# Altium project Elkapod_hardware_controller.PrjPcb
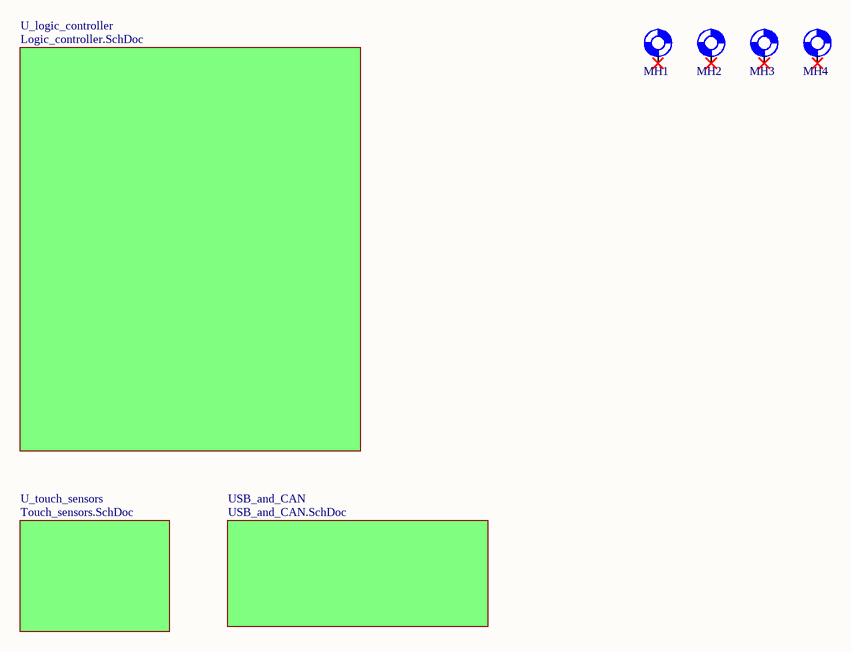
[diagram p0: Schield_elkapod.SchDoc]
4 sheets, 85 parts. Net scope: flat (ports and power ports of the same name join across sheets).
Board file: Elkapod_hardware_controller.PcbDoc
Sheets:
  Schield_elkapod.SchDoc
    U_logic_controller = Logic_controller.SchDoc
    U_touch_sensors = Touch_sensors.SchDoc
    USB_and_CAN = USB_and_CAN.SchDoc

## Sheet Schield_elkapod.SchDoc
size A4; SheetNumber: 1; SheetTotal: 4

### Parts
MH1  M3 Mounting Hole  [M3_MOUNTING_HOLE]  (value not drawn)
MH2  M3 Mounting Hole  [M3_MOUNTING_HOLE]  (value not drawn)
MH3  M3 Mounting Hole  [M3_MOUNTING_HOLE]  (value not drawn)
MH4  M3 Mounting Hole  [M3_MOUNTING_HOLE]  (value not drawn)

### Sub-sheets
U_logic_controller = Logic_controller.SchDoc: no entries
U_touch_sensors = Touch_sensors.SchDoc: no entries
USB_and_CAN = USB_and_CAN.SchDoc: no entries

### Nets

Not connected (* = marked no-connect by the designer): MH1 1*; MH2 1*; MH3 1*; MH4 1*

## Sheet Logic_controller.SchDoc
size A3; SheetNumber: 2; SheetTotal: 6
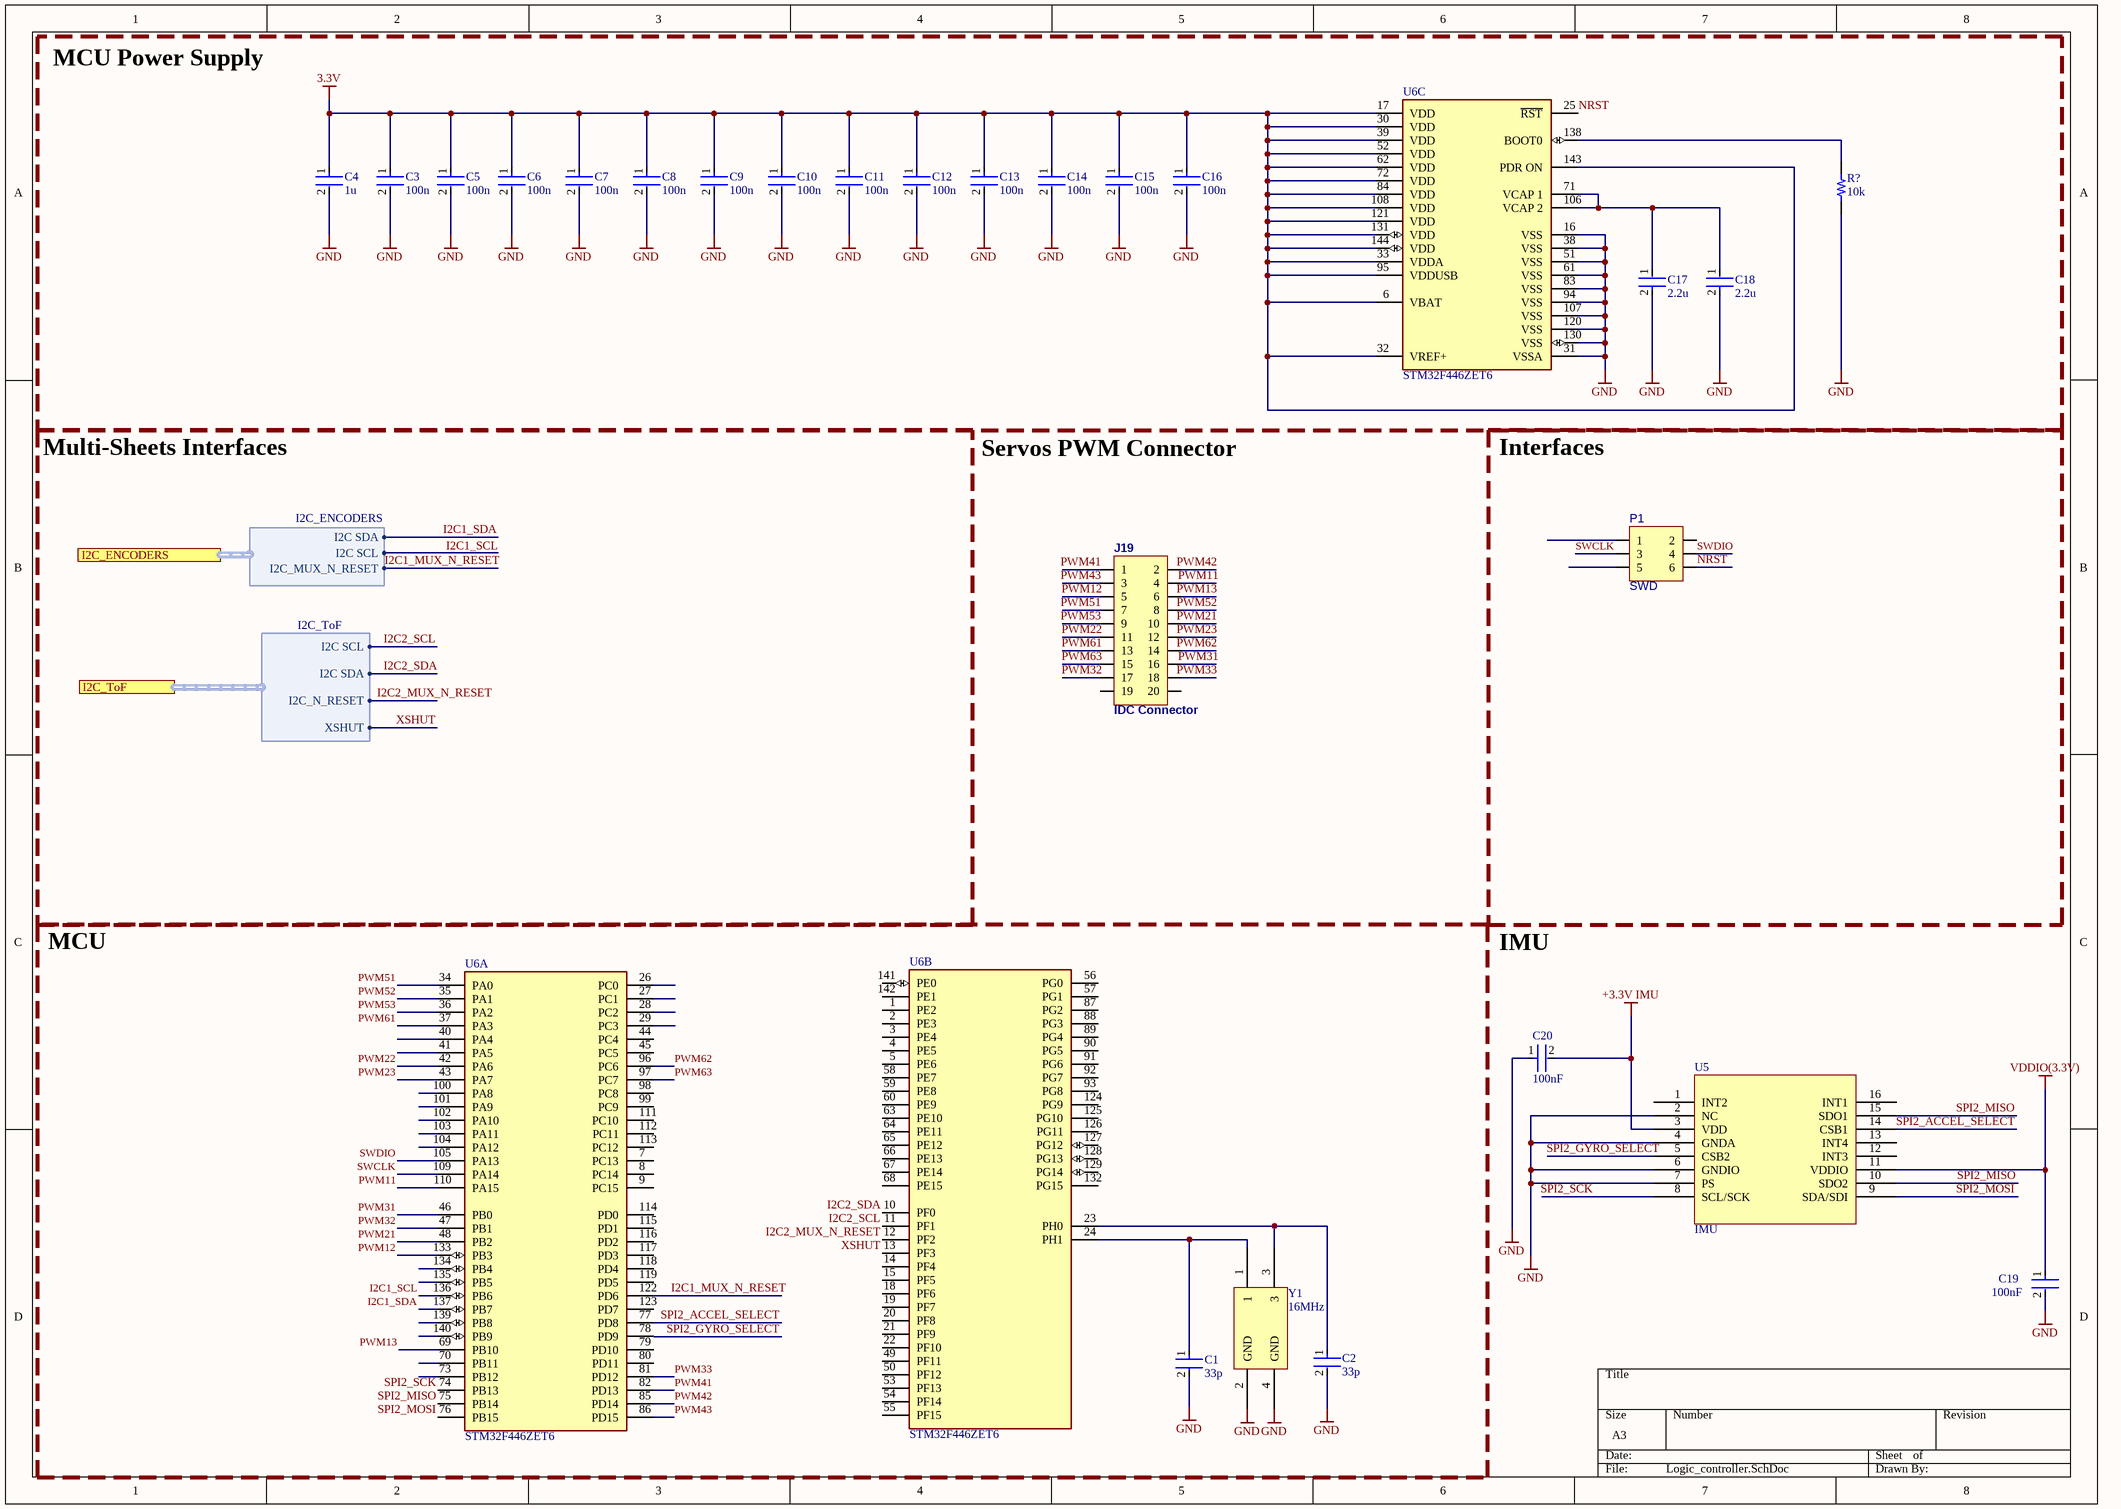
[diagram p1: Logic_controller.SchDoc]

### Parts
(Parts that share a designator on the sheet are numbered #1, #2 ... from top to bottom, then left to right.)
C1#1  33p  [FP-C0603C-CF-MFG]
C2#1  33p  [FP-C0603C-CF-MFG]
C3#1  100n  [FP-C0603C-CF-MFG]
C4#1  1u  [FP-C0603C-CF-MFG]
C5#1  100n  [FP-C0603C-CF-MFG]
C6#1  100n  [FP-C0603C-CF-MFG]
C7#1  100n  [FP-C0603C-CF-MFG]
C8#1  100n  [FP-C0603C-CF-MFG]
C9  100n  [FP-C0603C-CF-MFG]
C10  100n  [FP-C0603C-CF-MFG]
C11  100n  [FP-C0603C-CF-MFG]
C12  100n  [FP-C0603C-CF-MFG]
C13  100n  [FP-C0603C-CF-MFG]
C14  100n  [FP-C0603C-CF-MFG]
C15  100n  [FP-C0603C-CF-MFG]
C16  100n  [FP-C0603C-CF-MFG]
C17  2.2u  [FP-C1608-080-0_1-MFG]
C18  2.2u  [FP-C1608-080-0_1-MFG]
C19  100nF  [FP-CC0603-DA-MFG]
C20  100nF  [FP-CC0603-DA-MFG]
J19  IDC Connector  [IDC20]
P1  SWD  [GP_3x2]
R?  10k  [RES 0603_1608]
U5  IMU  [BMI088-Footprint-1]
U6#1  STM32F446ZET6  [FP-STM32F446ZET6-IPC_C]  (parts A,B,C of 3)
Y1  16MHz  [New footprint 1]

### Blocks framed on the sheet
MCU Power Supply: C3#1 C4#1 C5#1 C6#1 C7#1 C8#1 C9-C18 R? U6#1
Interfaces: P1
MCU: C1#1 C2#1 U6#1 Y1

### Ports
I2C_ENCODERS (harness I2C_ENCODERS, see Schield_elkapod[2B], Connection_of_encoders[1A]), I2C_ToF (harness I2C_ToF, see Schield_elkapod[2A], ToF_sensors[1A])

### Harnesses
I2C_ENCODERS: I2C SDA, I2C SCL, I2C_MUX_N_RESET
I2C_ToF: I2C SCL, I2C SDA, I2C_N_RESET, XSHUT

### Nets
3.3V: C3#1.1 C4#1.1 C5#1.1 C6#1.1 C7#1.1 C8#1.1 C9.1 C10.1 C11.1 C12.1 C13.1 C14.1 C15.1 C16.1 U6#1.6(VBAT) U6#1.17(VDD) U6#1.30(VDD) U6#1.32(VREF+) U6#1.33(VDDA) U6#1.39(VDD) U6#1.52(VDD) U6#1.62(VDD) U6#1.72(VDD) U6#1.84(VDD) U6#1.95(VDDUSB) U6#1.108(VDD) U6#1.121(VDD) U6#1.131(VDD) U6#1.143(PDR_ON) U6#1.144(VDD)
+3.3V IMU: C20.2 U5.3(VDD)
GND: C1#1.2 C2#1.2 C3#1.2 C4#1.2 C5#1.2 C6#1.2 C7#1.2 C8#1.2 C9.2 C10.2 C11.2 C12.2 C13.2 C14.2 C15.2 C16.2 C17.2 C18.2 C19.2 C20.1 R?.2 U5.2(NC) U5.4(GNDA) U5.6(GNDIO) U5.7(PS) U6#1.16(VSS) U6#1.31(VSSA) U6#1.38(VSS) U6#1.51(VSS) U6#1.61(VSS) U6#1.83(VSS) U6#1.94(VSS) U6#1.107(VSS) U6#1.120(VSS) U6#1.130(VSS) Y1.2(GND) Y1.4(GND)
VDDIO(3.3V): C19.1 U5.11(VDDIO)
I2C1_MUX_N_RESET: U6#1.122(PD6) ; port I2C_ENCODERS.I2C_MUX_N_RESET
I2C1_SCL: U6#1.136(PB6) ; port I2C_ENCODERS.I2C SCL
I2C1_SDA: U6#1.137(PB7) ; port I2C_ENCODERS.I2C SDA
I2C2_MUX_N_RESET: U6#1.12(PF2) ; port I2C_ToF.I2C_N_RESET
I2C2_SCL: U6#1.11(PF1) ; port I2C_ToF.I2C SCL
I2C2_SDA: U6#1.10(PF0) ; port I2C_ToF.I2C SDA
NRST: P1.6 U6#1.25(~{RST})
PWM11: J19.4 U6#1.110(PA15)
PWM12: J19.5 U6#1.133(PB3)
PWM13: J19.6 U6#1.69(PB10)
PWM21: J19.10 U6#1.48(PB2)
PWM22: J19.11 U6#1.42(PA6)
PWM23: J19.12 U6#1.43(PA7)
PWM31: J19.16 U6#1.46(PB0)
PWM32: J19.17 U6#1.47(PB1)
PWM33: J19.18 U6#1.81(PD12)
PWM41: J19.1 U6#1.82(PD13)
PWM42: J19.2 U6#1.85(PD14)
PWM43: J19.3 U6#1.86(PD15)
PWM51: J19.7 U6#1.34(PA0)
PWM52: J19.8 U6#1.35(PA1)
PWM53: J19.9 U6#1.36(PA2)
PWM61: J19.13 U6#1.37(PA3)
PWM62: J19.14 U6#1.96(PC6)
PWM63: J19.15 U6#1.97(PC7)
SPI2_ACCEL_SELECT: U5.14(CSB1) U6#1.77(PD8)
SPI2_GYRO_SELECT: U5.5(CSB2) U6#1.78(PD9)
SPI2_MISO: U5.10(SDO2) U5.15(SDO1) U6#1.75(PB14)
SPI2_MOSI: U5.9(SDA/SDI) U6#1.76(PB15)
SPI2_SCK: U5.8(SCL/SCK) U6#1.74(PB13)
SWCLK: P1.3 U6#1.109(PA14)
SWDIO: P1.4 U6#1.105(PA13)
XSHUT: U6#1.13(PF3) ; port I2C_ToF.XSHUT
NetC1#1_1: C1#1.1 U6#1.24(PH1) Y1.1
NetC2#1_1: C2#1.1 U6#1.23(PH0) Y1.3
NetC17_1: C17.1 C18.1 U6#1.71(VCAP_1) U6#1.106(VCAP_2)
NetR?_1: R?.1 U6#1.138(BOOT0)

Not connected (* = marked no-connect by the designer): J19 19 20; P1 1 2 5; U5 1(INT2) 12(INT3) 13(INT4) 16(INT1); U6#1 1(PE2) 2(PE3) 3(PE4) 4(PE5) 5(PE6) 7(PC13) 8(PC14) 9(PC15) 14(PF4) 15(PF5) 18(PF6) 19(PF7) 20(PF8) 21(PF9) 22(PF10) 26(PC0) 27(PC1) 28(PC2) 29(PC3) 40(PA4) 41(PA5) 44(PC4) 45(PC5) 49(PF11) 50(PF12) 53(PF13) 54(PF14) 55(PF15) 56(PG0) 57(PG1) 58(PE7) 59(PE8) 60(PE9) 63(PE10) 64(PE11) 65(PE12) 66(PE13) 67(PE14) 68(PE15) 70(PB11) 73(PB12) 79(PD10) 80(PD11) 87(PG2) 88(PG3) 89(PG4) 90(PG5) 91(PG6) 92(PG7) 93(PG8) 98(PC8) 99(PC9) 100(PA8) 101(PA9) 102(PA10) 103(PA11) 104(PA12) 111(PC10) 112(PC11) 113(PC12) 114(PD0) 115(PD1) 116(PD2) 117(PD3) 118(PD4) 119(PD5) 123(PD7) 124(PG9) 125(PG10) 126(PG11) 127(PG12) 128(PG13) 129(PG14) 132(PG15) 134(PB4) 135(PB5) 139(PB8) 140(PB9) 141(PE0) 142(PE1)

### Notes on the sheet
- Multi-Sheets Interfaces
- Servos PWM Connector
- IMU

### Library data of the parts
C1#1 C2#1 = CMP-03020-030291-1: Cap Ceramic 0.0027uF 25V C0G 1% SMD 0603 125°C Paper T/R; Manufacturer: KEMET; Manufacturer Part Number: C0603C272F3GAC7867; Automotive Grade: Grade 1; Tolerance: 0.01; Value: 2,700 pF; Temperature Coefficient: 30ppm/°C; Material: Ceramic; Device Class L2: Capacitors; Device Class L3: Ceramic Capacitors; ComponentLink2Description: Datasheet; Category: Cap; Automotive: Yes; Octopart: https://octopart.com/c0603c272f3gac7867-kemet-90390867; Temperature Range High: +125°C; Package: C0603C-CF; Device Class L1: Passive Components; Digikey Description: Cap Ceramic 0.0027uF 25V C0G 1% SMD 0603 125°C Paper T/R; Temperature Characteristic: C0G; Temperature Range Low: -55°C; Temperature: -55°C to +125°C; Height: 0.87mm; ComponentLink2URL: https://api.kemet.com/component-edge/download/datasheet/C0603C100J5GACAUTO.pdf; Voltage Rating: 25 V; Capacitance: 2,700 pF; Lead Free: Yes; RoHS: TRUE
C3#1 C5#1 C6#1 C7#1 C8#1 C9-C16 = CMP-03020-030291-1: CAP CER 100nF 25V X5R 0603 C0603C272F3GAC7867; Manufacturer: KEMET; Material: Ceramic; Automotive Grade: Grade 1; Tolerance: 0.01; Temperature Characteristic: C0G; Value: 2,700 pF; Temperature Coefficient: 30ppm/°C; Device Class L2: Capacitors; Device Class L3: Ceramic Capacitors; ComponentLink2Description: Datasheet; Category: Cap; Automotive: Yes; Octopart: https://octopart.com/c0603c272f3gac7867-kemet-90390867; Temperature Range High: +125°C; Package: C0603C-CF; Device Class L1: Passive Components; Digikey Description: Cap Ceramic 0.0027uF 25V C0G 1% SMD 0603 125°C Paper T/R; Temperature Range Low: -55°C; Temperature: -55°C to +125°C; Height: 0.87mm; ComponentLink2URL: https://api.kemet.com/component-edge/download/datasheet/C0603C100J5GACAUTO.pdf; Voltage Rating: 25 V; Capacitance: 2,700 pF; Lead Free: Yes; Manufacturer Part Number: C0603C272F3GAC7867; RoHS: TRUE
C4#1 = CMP-03020-030291-1: CAP CER 1uF 16V X5R 0603 C0603C272F3GAC7867; Manufacturer: KEMET; Material: Ceramic; Automotive Grade: Grade 1; Tolerance: 0.01; Temperature Characteristic: C0G; Value: 2,700 pF; Voltage Rating: 25 V; Temperature Coefficient: 30ppm/°C; Device Class L2: Capacitors; Device Class L3: Ceramic Capacitors; ComponentLink2Description: Datasheet; Category: Cap; Automotive: Yes; Octopart: https://octopart.com/c0603c272f3gac7867-kemet-90390867; Temperature Range High: +125°C; Package: C0603C-CF; Device Class L1: Passive Components; Digikey Description: Cap Ceramic 0.0027uF 25V C0G 1% SMD 0603 125°C Paper T/R; Temperature Range Low: -55°C; Temperature: -55°C to +125°C; Height: 0.87mm; ComponentLink2URL: https://api.kemet.com/component-edge/download/datasheet/C0603C100J5GACAUTO.pdf; Capacitance: 2,700 pF; Lead Free: Yes; Manufacturer Part Number: C0603C272F3GAC7867; RoHS: TRUE
C17 C18 = CMP-08246-003049-1: Multilayer Ceramic Capacitors 2.2μF ±10% 25V X5R SMD 0603 C1608X5R1E225K080AB; Capacitance: 2.2uF; Termination: SMD/SMT; Dielectric Material: Ceramic; REACH SVHC: No SVHC; Voltage Rating (DC): 25V; Voltage Rating: 25V; RoHS Compliant: Yes; Case Code (Imperial): 0603; Case/Package: 0603; Height: 0.8mm; Mount: Surface Mount; Min Operating Temperature: -55°C; Tolerance: 10%; Radiation Hardening: No; Dielectric: X5R; Depth: 0.8mm; Package Quantity: 4000; Length: 1.6mm; Weight: 7.1E-05oz; Resistor Type: Ceramic; Series: C; Thickness: 0.035inch; Width: 0.031inch; Case Code (Metric): 1608; Lead Free: Lead Free; Max Operating Temperature: 85°C; Packaging: Tape and Reel
C19 C20 = CMP-2100-03601-2: CAP CER 0.1UF 50V X7R 0603 CC0603KRX7R9BB104; Manufacturer: YAGEO; Material: Ceramic; Temperature Coefficient: 15%; Tolerance: 0.1; Height: 0.9mm; Voltage: 50 V; ComponentLink2Description: Datasheet; Device Class L2: Capacitors; Temperature Range High: +125°C; Category: Cap; Capacitance: 100 nF; Footprint Url: http://www.yageo.com/exep/pages/download/literatures/UPY-C_GEN_24.pdf; ComponentLink2URL: http://www.yageo.com/documents/recent/UPY-GPHC_X7R_6.3V-to-50V_18.pdf; Package: CC0603-DA; Temperature: -55°C to +125°C; Voltage Rating: 50 V; Temperature Characteristic: X7R; Device Class L1: Passive Components; Temperature Range Low: -55°C; Manufacturer Part Number: CC0603KRX7R9BB104; RoHS: TRUE; Automotive: No; Value: 100 nF; Device Class L3: Ceramic Capacitors; Octopart: https://octopart.com/cc0603krx7r9bb104-yageo-42244635; Mouser Description: Multilayer Ceramic Capacitor, CC Series, 0.1 - F, - 10%, X7R, 50 V, 0603 [1608 Metric]; Lead Free: Yes; Digikey Description: CAP CER 0.1UF 50V X7R 0603
J19 = CN_10x2
P1 = CN_3x2
R? = RNCS0603BKE10K0: RES 10K OHM 1% 0,1W 0603; Manufacturer: Stackpole Electronics Inc; Power (Watts): 0.063W, 1/16W; Temperature Coefficient: ±25ppm/°C; Tolerance: ±0.1%; Part Number: RNCS0603BKE10K0; Value: 10k; Composition: Thin Film; Device Package: 0603 (1608 Metric); Features: Anti-Corrosive, Automotive AEC-Q200, Moisture Resistant; Height - Seated (Max): 0.022" (0.55mm); LastUpdated: 09.02.2024 20:43:37; Lifecycle Status: Active; Minimum Order: 1; Number of Terminations: 2; Operating Temperature: -55°C ~ 155°C; Package / Case: 0603 (1608 Metric); Packaging: TapeAndReel; PartId: 4838; Part Status: Active; Price: 0.06; Ratings: AEC-Q200; Resistance: 10k; Series: RNCS; Size / Dimension: 0.061" L x 0.031" W (1.55mm x 0.80mm); Supplier Device Package: 0603
U5 = CMP-00030-00005-6: BMI088 Series 3.6 V 6 Axis Digital Output Accelerometer Motion Sensor - LGA-16
U6#1 = CMP-12105-000067-1: IC MCU 32BIT 512KB FLASH 144LQFP; Manufacturer: STMicroelectronics; Standoff Height: 0.05mm; Memory Size: 512KBytes; Data Bus Width: 32bits; Number Of Timers/Counters: 14; Number Of I2C Channels: 4; Number Of Usb Channels: 2; Frequency: 180MHz; Ram Size: 128KBytes; Number Of I/Os: 114; Min Supply Voltage: 1.7V; Max Junction Temp: +105°C; Number Of Cores: 1; Core Architecture: Arm Cortex-M4; Max Supply Voltage: 3.6V; Number Of Adc Channels: 24; Number Of Pwm Channels: 32; Number Of Uart Channels: 6; Number Of A/D Converters: 3; Interface: I2C,SPI,UART,USART,EBI/EMI,CAN,USB,LIN,IrDA,I2S,SMBus,Other; Mouser Description: 32 Bit Microcontroller, High Performance, Arm Cortex-M4, 180 Mhz, 512 Kb, 128 Kb, 144, Lqfp; Temperature Range High: +105°C; Device Class L3: Microcontrollers; Ambient Temperature Range High: +85°C; Lead Free: Yes; Octopart: https://octopart.com/stm32f446zet6-stmicroelectronics-52642927; Device Class L2: Embedded Processors and Controllers; Height: 1.6mm; Category: IC; Manufacturer Part Number: STM32F446ZET6; RoHS: TRUE; Memory Type: FLASH; Temperature: -40°C to +105°C; Number Of Spi Channels: 4; Device Class L1: Integrated Circuits (ICs); Package: LQFP144; Digikey Description: IC MCU 32BIT 512KB FLASH 144LQFP; Automotive: No; ComponentLink2Description: Datasheet; ComponentLink2URL: https://www.st.com/content/ccc/resource/technical/document/datasheet/65/cb/75/50/53/d6/48/24/DM00141306.pdf/files/DM00141306.pdf/jcr:content/translations/en.DM00141306.pdf; Ambient Temperature Range Low: -40°C; Temperature Range Low: -40°C
Y1 = CMP-00030-00007-3: resonator 16MHz LFXTAL030819BULK

## Sheet Touch_sensors.SchDoc
size A4; SheetNumber: 4; SheetTotal: 4
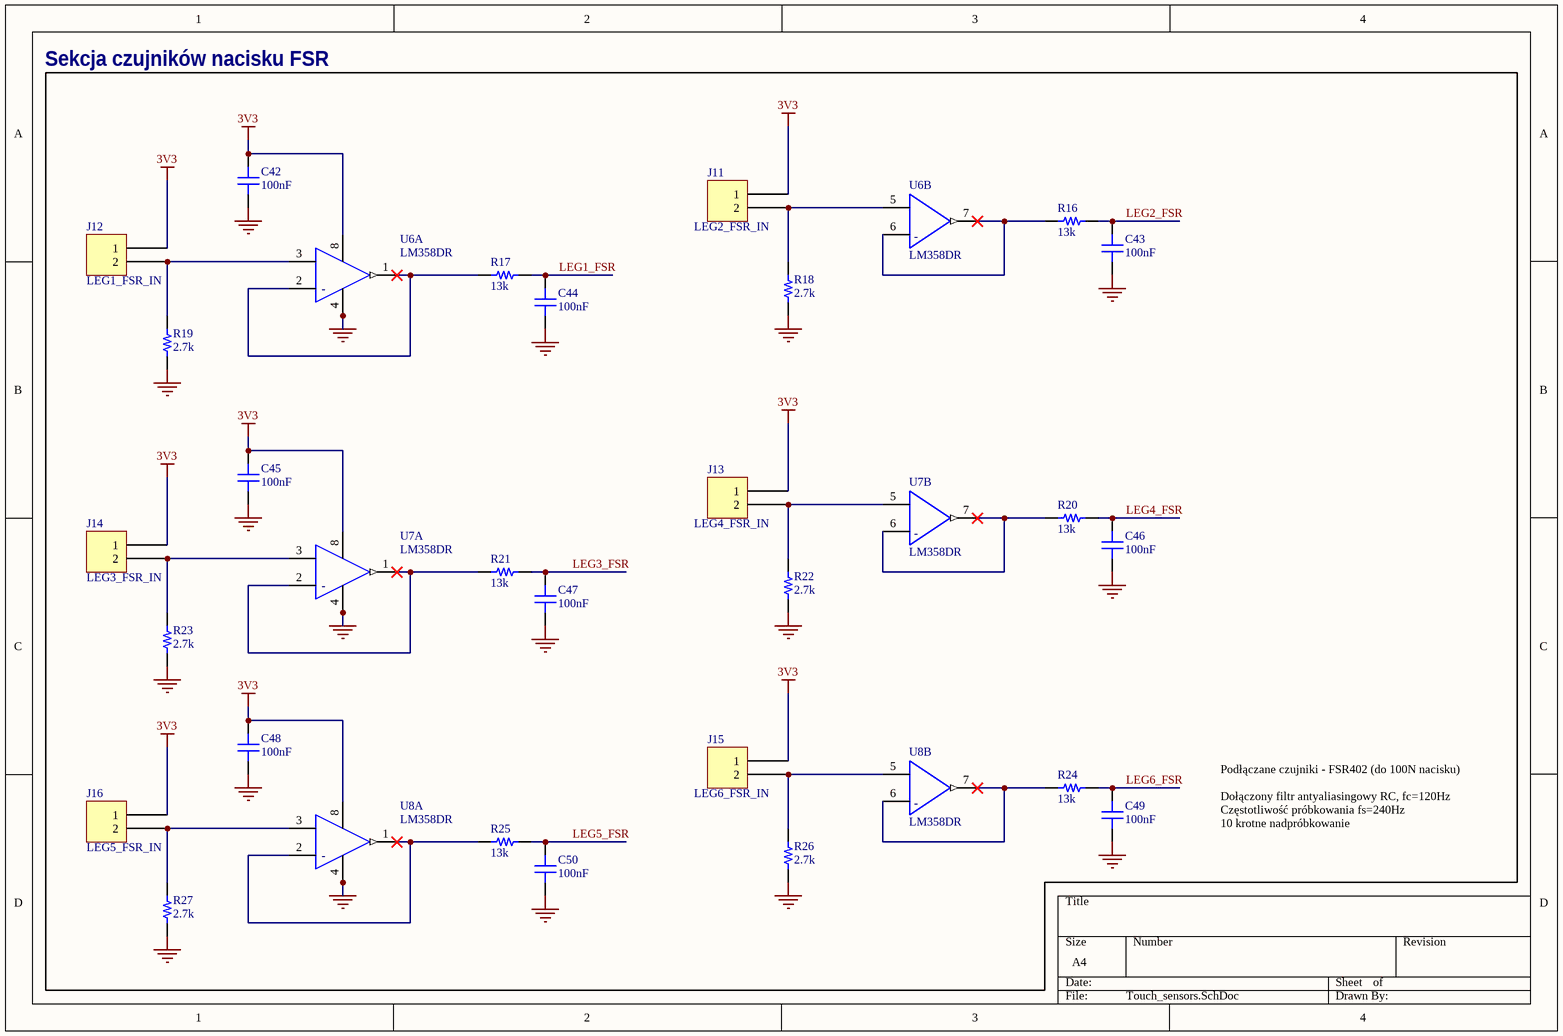
[diagram p2: Touch_sensors.SchDoc]

### Parts
(Parts that share a designator on the sheet are numbered #1, #2 ... from top to bottom, then left to right.)
C42  Capacitance: 100nF  [CAP 0603_1608]  (hidden comment: 0.1 µF)
C43  Capacitance: 100nF  [CAP 0603_1608]  (hidden comment: 0.1 µF)
C44  Capacitance: 100nF  [CAP 0603_1608]  (hidden comment: 0.1 µF)
C45  Capacitance: 100nF  [CAP 0603_1608]  (hidden comment: 0.1 µF)
C46  Capacitance: 100nF  [CAP 0603_1608]  (hidden comment: 0.1 µF)
C47  Capacitance: 100nF  [CAP 0603_1608]  (hidden comment: 0.1 µF)
C48  Capacitance: 100nF  [CAP 0603_1608]  (hidden comment: 0.1 µF)
C49  Capacitance: 100nF  [CAP 0603_1608]  (hidden comment: 0.1 µF)
C50  Capacitance: 100nF  [CAP 0603_1608]  (hidden comment: 0.1 µF)
J11  LEG2_FSR_IN  [JST XH B2B-XH-A]
J12  LEG1_FSR_IN  [JST XH B2B-XH-A]
J13  LEG4_FSR_IN  [JST XH B2B-XH-A]
J14  LEG3_FSR_IN  [JST XH B2B-XH-A]
J15  LEG6_FSR_IN  [JST XH B2B-XH-A]
J16  LEG5_FSR_IN  [JST XH B2B-XH-A]
R16  13k  [RES 0603_1608]
R17  13k  [RES 0603_1608]
R18  2.7k  [YAGEO RES 0603_1608]
R19  2.7k  [YAGEO RES 0603_1608]
R20  13k  [RES 0603_1608]
R21  13k  [RES 0603_1608]
R22  2.7k  [YAGEO RES 0603_1608]
R23  2.7k  [YAGEO RES 0603_1608]
R24  13k  [RES 0603_1608]
R25  13k  [RES 0603_1608]
R26  2.7k  [YAGEO RES 0603_1608]
R27  2.7k  [YAGEO RES 0603_1608]
U6#2  LM358DR  [FP-D0008A-MFG]  (parts A,B of 2)
U7  LM358DR  [FP-D0008A-MFG]  (parts A,B of 2)
U8  LM358DR  [FP-D0008A-MFG]  (parts A,B of 2)

### Nets
3V3: C42.2 C45.2 C48.2 J11.1 J12.1 J13.1 J14.1 J15.1 J16.1 U6#2.8(V+) U7.8(V+) U8.8(V+)
GND: C42.1 C43.1 C44.1 C45.1 C46.1 C47.1 C48.1 C49.1 C50.1 R18.1 R19.1 R22.1 R23.1 R26.1 R27.1 U6#2.4(V-) U7.4(V-) U8.4(V-)
LEG1_FSR: C44.2 R17.2
LEG2_FSR: C43.2 R16.2
LEG3_FSR: C47.2 R21.2
LEG4_FSR: C46.2 R20.2
LEG5_FSR: C50.2 R25.2
LEG6_FSR: C49.2 R24.2
NetJ11_2: J11.2 R18.2 U6#2.5(IN2+)
NetJ12_2: J12.2 R19.2 U6#2.3(IN1+)
NetJ13_2: J13.2 R22.2 U7.5(IN2+)
NetJ14_2: J14.2 R23.2 U7.3(IN1+)
NetJ15_2: J15.2 R26.2 U8.5(IN2+)
NetJ16_2: J16.2 R27.2 U8.3(IN1+)
NetR16_1: R16.1 U6#2.6(IN2-) U6#2.7(2OUT)
NetR17_1: R17.1 U6#2.1(1OUT) U6#2.2(IN1-)
NetR20_1: R20.1 U7.6(IN2-) U7.7(2OUT)
NetR21_1: R21.1 U7.1(1OUT) U7.2(IN1-)
NetR24_1: R24.1 U8.6(IN2-) U8.7(2OUT)
NetR25_1: R25.1 U8.1(1OUT) U8.2(IN1-)

### Notes on the sheet
- Sekcja czujników nacisku FSR
- Podłączane czujniki - FSR402 (do 100N nacisku)
  Dołączony filtr antyaliasingowy RC, fc=120Hz
  Częstotliwość próbkowania fs=240Hz
  10 krotne nadpróbkowanie
- (in symbol CMP-1685-00009-2, part A) -
- (in symbol CMP-1685-00009-2, part B) -

### Library data of the parts
C42-C50 = CL10B104KA8NNNC: CAP CER 0.1UF 25V X7R 0603; manufacturer: Samsung Electro-Mechanics; Tolerance: ±10%; Part Number: CL10B104KA8NNNC; Applications: General Purpose; componentlink1description: Datasheet; componentlink1url: http://www.samsungsem.com/kr/support/product-search/mlcc/CL10B104KA8NNNC.jsp; componentlink2description: DigiKey Link; componentlink2url: https://www.digikey.com/en/products/detail/samsung-electro-mechanics/CL10B104KA8NNNC/3886664; Device Package: 0603 (1608 Metric); lastupdated: 09/02/2024 20:10:20; Lifecycle Status: Active; Minimum Order: 1; Mounting Type: Surface Mount, MLCC; Operating Temperature: -55°C ~ 125°C; Package / Case: 0603 (1608 Metric); packaging: TapeAndReel; partid: 9793; Part Status: Active; price: 0.01; series: CL; Size / Dimension: 0.063" L x 0.031" W (1.60mm x 0.80mm); Supplier 1: DigiKey; Supplier Part Number 1: 1276-1006-1-ND; Temperature Coefficient: X7R; Thickness (Max): 0.035" (0.90mm); value: 0.1 µF; Voltage - Rated: 25V
J11-J16 = B2B-XH-A(LF)(SN): CONN HEADER VERT 2POS 2.5MM; Manufacturer: JST Sales America Inc.; Contact Length - Post: 0.134" (3.40mm); Current Rating (Amps): 3A; Material Flammability Rating: UL94 V-0; Number of Positions: 2; Number of Positions Loaded: All; Pitch - Mating: 0.098" (2.50mm); Shrouding: Shrouded - 4 Wall; Style: Board to Cable/Wire; Voltage Rating: 250V; Part Number: B2B-XH-A(LF)(SN); ComponentLink1Description: Datasheet; ComponentLink1URL: http://www.jst-mfg.com/product/pdf/eng/eXH.pdf; ComponentLink2Description: DigiKey Link; ComponentLink2URL: http://digikey.com/product-detail/en/jst-sales-america-inc/B2B-XH-A-LF-SN/455-2247-ND/1651045; Connector Type: Header; Contact Finish - Mating: Tin; Contact Finish - Post: Tin; Contact Material: Brass; Contact Shape: Square; Contact Type: Male Pin; Fastening Type: Detent Lock; Insulation Color: Natural; Insulation Height: 0.276" (7.00mm); Insulation Material: Polyamide (PA66), Nylon 6/6; LastUpdated: 12/01/2020 23:46:08; Lifecycle Status: Active; Minimum Order: 1; Mounting Type: Through Hole; Number of Rows: 1; Operating Temperature: -25°C ~ 85°C; Packaging: Bulk; PartId: 67; Part Status: Active; Price: 0.15; Series: XH; Supplier 1: DigiKey; Supplier Part Number 1: 455-2247-ND; Termination: Press-Fit, Solder
R16 R17 R20 R21 R24 R25 = ERJ-3EKF1302V: RES SMD 13K OHM 1% 1/10W 0603; Manufacturer: Panasonic Electronic Components; Power (Watts): 0.1W, 1/10W; Resistance: 13 kOhms; Temperature Coefficient: ±100ppm/°C; Part Number: ERJ-3EKF1302V; Value: 13k; ComponentLink1Description: Datasheet; ComponentLink1URL: https://industrial.panasonic.com/cdbs/www-data/pdf/RDA0000/AOA0000C304.pdf; ComponentLink2Description: DigiKey Link; ComponentLink2URL: https://www.digikey.com/en/products/detail/panasonic-electronic-components/ERJ-3EKF1302V/196110; Composition: Thick Film; Device Package: 0603 (1608 Metric); Features: Automotive AEC-Q200; Height - Seated (Max): 0.022" (0.55mm); LastUpdated: 09/02/2024 20:42:14; Lifecycle Status: Active; Minimum Order: 1; Number of Terminations: 2; Operating Temperature: -55°C ~ 155°C; Package / Case: 0603 (1608 Metric); Packaging: TapeAndReel; PartId: 24117; Part Status: Active; Price: 0.01; Ratings: AEC-Q200; Series: ERJ-3EK; Size / Dimension: 0.063" L x 0.031" W (1.60mm x 0.80mm); Supplier 1: DigiKey; Supplier Part Number 1: P13.0KHCT-ND; Supplier Device Package: 0603; Tolerance: ±1%
R18 R19 R22 R23 R26 R27 = AC0603FR-072K7L: RES SMD 2.7K OHM 1% 1/10W 0603; Manufacturer: Yageo; Power (Watts): 0.1W, 1/10W; Resistance: 2.7 kOhms; Temperature Coefficient: ±100ppm/°C; Part Number: AC0603FR-072K7L; Value: 2.7k; ComponentLink1Description: Datasheet; ComponentLink1URL: https://www.yageo.com/upload/media/product/productsearch/datasheet/rchip/PYu-AC_51_RoHS_L_7.pdf; ComponentLink2Description: DigiKey Link; ComponentLink2URL: https://www.digikey.com/en/products/detail/yageo/AC0603FR-072K7L/5895994; Composition: Thick Film; Device Package: 0603 (1608 Metric); Features: Automotive AEC-Q200, Moisture Resistant; Height - Seated (Max): 0.022" (0.55mm); LastUpdated: 25/07/2024 09:19:23; Lifecycle Status: Active; Minimum Order: 1; Number of Terminations: 2; Operating Temperature: -55°C ~ 155°C; Package / Case: 0603 (1608 Metric); Packaging: CutTape; PartId: 17370; Part Status: Active; Price: 0.01; Ratings: AEC-Q200; Series: AC; Size / Dimension: 0.063" L x 0.031" W (1.60mm x 0.80mm); Supplier 1: DigiKey; Supplier Part Number 1: YAG3589CT-ND; Supplier Device Package: 0603; Tolerance: ±1%
U6#2 U7 U8 = CMP-1685-00009-2: IC OPAMP GP 2 CIRCUIT 8SOIC; Output Current: 30mA; Min Dual Supply Voltage: 1.5V; Input Offset Voltage (Vos): 7mV; Power Supply Rejection Ratio (PSRR): 65dB; Unity Gain Bandwidth Product: 700kHz; Number of Channels: 2; Min Supply Voltage: 3V; Max Dual Supply Voltage: 16V; Dual Supply Voltage: 9V; Max Supply Voltage: 32V; Nominal Supply Current: 1.2mA; Slew Rate: 0.3V/µs; Input Bias Current: 250nA; Voltage Gain: 100dB; Operating Supply Current: 1mA; REACH SVHC: No SVHC; Package Quantity: 2500; Width: 3.91mm; Max Operating Temperature: 70°C; Min Operating Temperature: 0°C; Mount: Surface Mount; Length: 4.9mm; Radiation Hardening: No; Case/Package: SOIC; Lead Free: Lead Free; Number of Elements: 2; Packaging: Tape and Reel; Output Current per Channel: 30mA; Number of Circuits: 2; Bandwidth: 700kHz; Operating Supply Voltage: 16V; Gain Bandwidth Product: 700kHz; Number of Pins: 8; Number of Amplifiers: 2; Height: 1.58mm; Common Mode Rejection Ratio: 65dB; Contact Plating: Gold

## Sheet USB_and_CAN.SchDoc
size A4; SheetNumber: 2; SheetTotal: 4
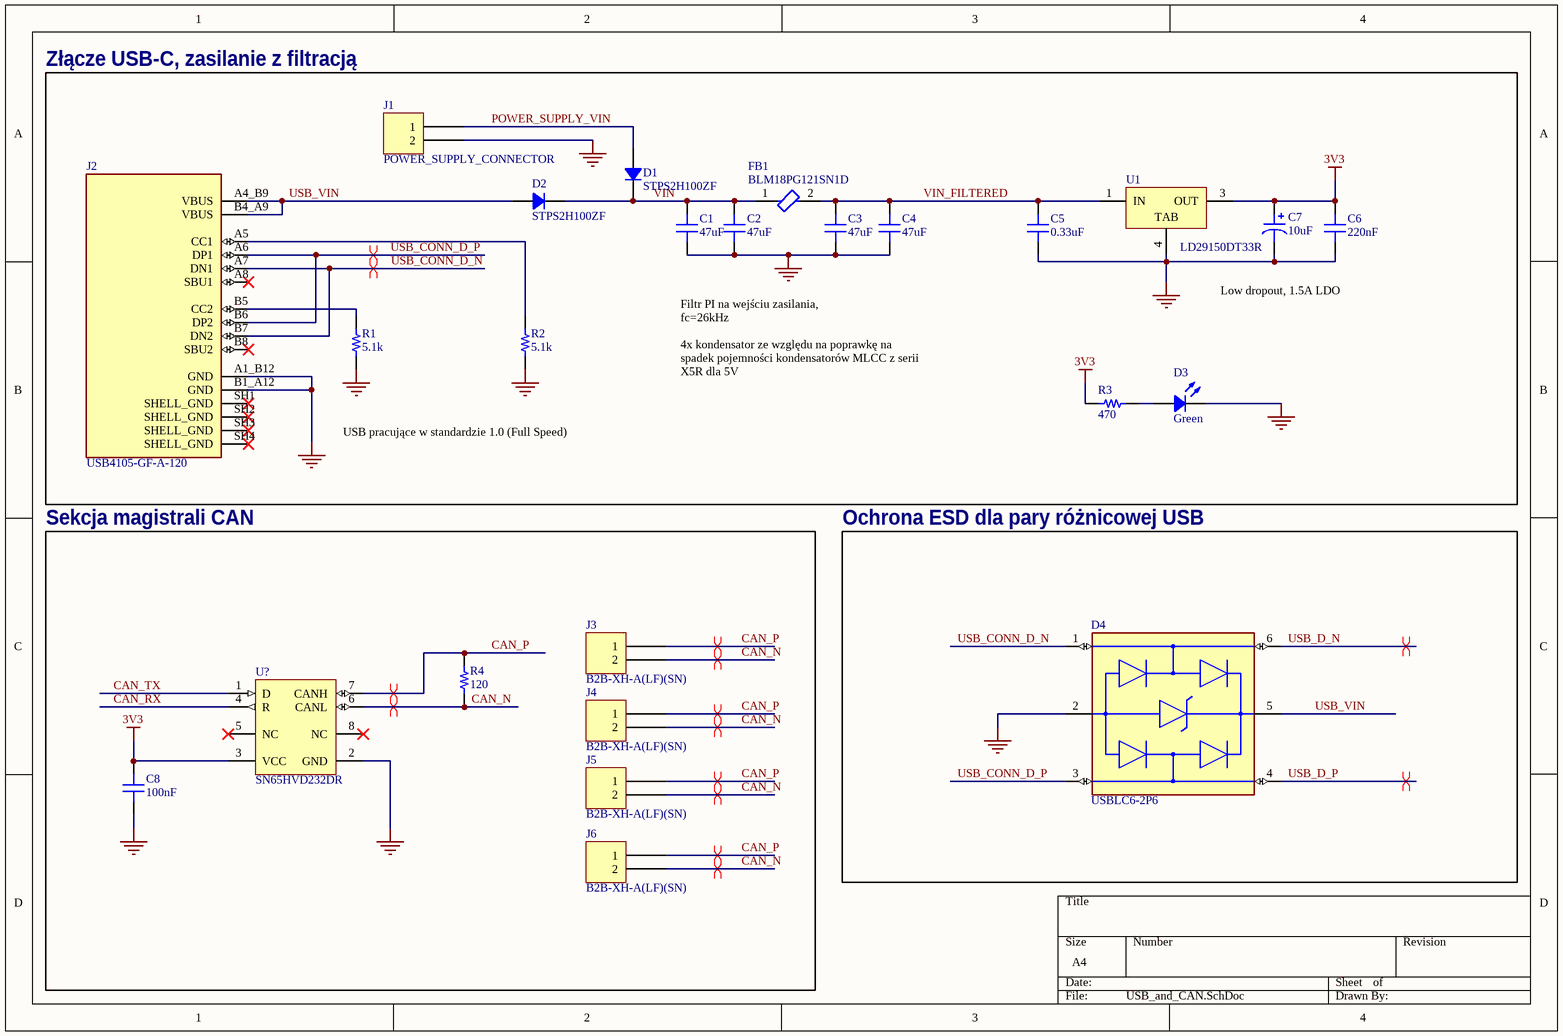
[diagram p3: USB_and_CAN.SchDoc]

### Parts
(Parts that share a designator on the sheet are numbered #1, #2 ... from top to bottom, then left to right.)
C1#2  Capacitance: 47uF  [MURATA GRM188 0603_1608]  (hidden comment: 47 µF)
C2#2  Capacitance: 47uF  [MURATA GRM188 0603_1608]  (hidden comment: 47 µF)
C3#2  Capacitance: 47uF  [MURATA GRM188 0603_1608]  (hidden comment: 47 µF)
C4#2  Capacitance: 47uF  [MURATA GRM188 0603_1608]  (hidden comment: 47 µF)
C5#2  Capacitance: 0.33uF  [CAP 0603_1608]  (hidden comment: 0.33 µF)
C6#2  Capacitance: 220nF  [CAP 0603_1608]  (hidden comment: 0.22 µF)
C7#2  10uF  [CAP ALSMD POLY 4.3MM H5.5MM]
C8#2  Capacitance: 100nF  [CAP 0603_1608]  (hidden comment: 0.1 µF)
D1  STPS2H100ZF  [SOD123F]
D2  STPS2H100ZF  [SOD123F]
D3  Green  [LED 0805_2012 GREEN]
D4  USBLC6-2P6  [FP-SOT-666-MFG]
FB1  BLM18PG121SN1D  [FP-BLM18-0_15-t0_8-IPC_A]
J1  POWER_SUPPLY_CONNECTOR  [MOLEX KK 0022272021]
J2  USB4105-GF-A-120  [USB4105-GF-A-120]
J3  B2B-XH-A(LF)(SN)  [JST XH B2B-XH-A]
J4  B2B-XH-A(LF)(SN)  [JST XH B2B-XH-A]
J5  B2B-XH-A(LF)(SN)  [JST XH B2B-XH-A]
J6  B2B-XH-A(LF)(SN)  [JST XH B2B-XH-A]
R1  5.1k  [RES 0603_1608]
R2  5.1k  [RES 0603_1608]
R3  470  [RES 0603_1608]
R4  120  [YAGEO RES 0603_1608]
U1  LD29150DT33R  [TO-252_L]
U?  SN65HVD232DR  [D0008A_M]

### Blocks framed on the sheet
Złącze USB-C, zasilanie z filtracją: C1#2 C2#2 C3#2 C4#2 C5#2 C6#2 C7#2 D1-D3 FB1 J1 J2 R1-R3 U1
Sekcja magistrali CAN: C8#2 J3-J6 R4 U?
Ochrona ESD dla pary różnicowej USB: D4

### Nets
3V3: C6#2.2 C7#2.1 C8#2.2 R3.1 U1.3(OUT) U?.3(VCC)
GND: C1#2.1 C2#2.1 C3#2.1 C4#2.1 C5#2.1 C6#2.1 C7#2.2 C8#2.1 D3.2 D4.2(GND) J1.2 J2.A1_B12(GND) J2.B1_A12(GND) R1.1 R2.1 U1.4(TAB) U?.2(GND)
CAN_N: J3.2 J4.2 J5.2 J6.2 R4.1 U?.6(CANL)
CAN_P: J3.1 J4.1 J5.1 J6.1 R4.2 U?.7(CANH)
CAN_RX: U?.4(R)
CAN_TX: U?.1(D)
POWER_SUPPLY_VIN: D1.1 J1.1
USB_CONN_D_N: D4.1(I/O1) J2.A7(DN1) J2.B7(DN2)
USB_CONN_D_P: D4.3(I/O2) J2.A6(DP1) J2.B6(DP2)
USB_D_N: D4.6(I/O1)
USB_D_P: D4.4(I/O2)
USB_VIN: D2.1 D4.5(VBUS) J2.A4_B9(VBUS) J2.B4_A9(VBUS)
VIN: C1#2.2 C2#2.2 D1.2 D2.2 FB1.1
VIN_FILTERED: C3#2.2 C4#2.2 C5#2.2 FB1.2 U1.1(IN)
NetD3_1: D3.1 R3.2
NetJ2_A5: J2.A5(CC1) R2.2
NetJ2_B5: J2.B5(CC2) R1.2

Not connected (* = marked no-connect by the designer): J2 A8(SBU1)* B8(SBU2)* SH1(SHELL_GND)* SH2(SHELL_GND)* SH3(SHELL_GND)* SH4(SHELL_GND)*; U? 5(NC)* 8(NC)*

### Layout directives
differential pair: CAN_N, CAN_P, USB_CONN_D_N, USB_CONN_D_P, USB_D_N, USB_D_P

### Notes on the sheet
- Low dropout, 1.5A LDO
- Filtr PI na wejściu zasilania,
  fc=26kHz
  4x kondensator ze względu na poprawkę na spadek pojemności kondensatorów MLCC z serii X5R dla 5V
- USB pracujące w standardzie 1.0 (Full Speed)

### Library data of the parts
C1#2 C2#2 C3#2 C4#2 = GRM188R60J476ME15D: CAP CER 47UF 6.3V X5R 0603; manufacturer: Murata Electronics; Tolerance: ±20%; Part Number: GRM188R60J476ME15D; Applications: General Purpose; componentlink1description: Datasheet; componentlink1url: https://www.murata.com/~/media/webrenewal/support/library/catalog/products/capacitor/mlcc/c02e.ashx?la=en-us; componentlink2description: DigiKey Link; componentlink2url: https://www.digikey.com/en/products/detail/murata-electronics/GRM188R60J476ME15D/5877410; Device Package: 0603 (1608 Metric); lastupdated: 20/07/2024 00:23:22; Lifecycle Status: Active; Minimum Order: 1; Mounting Type: Surface Mount, MLCC; Operating Temperature: -55°C ~ 85°C; Package / Case: 0603 (1608 Metric); packaging: TapeAndReel; partid: 5468; Part Status: Active; price: 0.10; series: GRM; Size / Dimension: 0.063" L x 0.031" W (1.60mm x 0.80mm); Supplier 1: DigiKey; Supplier Part Number 1: 490-13247-1-ND; Temperature Coefficient: X5R; Thickness (Max): 0.039" (1.00mm); value: 47 µF; Voltage - Rated: 6.3V
C5#2 = CL10B334KO8NNNC: CAP CER 0.33UF 16V X7R 0603; manufacturer: Samsung Electro-Mechanics; Tolerance: ±10%; Part Number: CL10B334KO8NNNC; Applications: General Purpose; componentlink1description: Datasheet; componentlink1url: http://www.samsungsem.com/kr/support/product-search/mlcc/CL10B334KO8NNNC.jsp; componentlink2description: DigiKey Link; componentlink2url: https://www.digikey.com/en/products/detail/samsung-electro-mechanics/CL10B334KO8NNNC/3887706; Device Package: 0603 (1608 Metric); lastupdated: 09/02/2024 20:10:28; Lifecycle Status: Active; Minimum Order: 1; Mounting Type: Surface Mount, MLCC; Operating Temperature: -55°C ~ 125°C; Package / Case: 0603 (1608 Metric); packaging: TapeAndReel; partid: 4324; Part Status: Active; price: 0.01; series: CL; Size / Dimension: 0.063" L x 0.031" W (1.60mm x 0.80mm); Supplier 1: DigiKey; Supplier Part Number 1: 1276-2048-1-ND; Temperature Coefficient: X7R; Thickness (Max): 0.035" (0.90mm); value: 0.33 µF; Voltage - Rated: 16V
C6#2 = C0603C224K4RECAUTO: CAP CER 0603 220NF 16V X7R 10%; manufacturer: KEMET; Part Number: C0603C224K4RECAUTO; Applications: Automotive, ESD Protection; componentlink1description: Datasheet; componentlink1url: https://api.kemet.com/component-edge/download/datasheet/C0603C224K4RECAUTO.pdf; componentlink2description: DigiKey Link; componentlink2url: https://www.digikey.com/en/products/detail/kemet/C0603C224K4RECAUTO/8640476; Device Package: 0603 (1608 Metric); lastupdated: 09/02/2024 20:10:12; Lifecycle Status: Active; Minimum Order: 1; Mounting Type: Surface Mount, MLCC; Operating Temperature: -55°C ~ 125°C; Package / Case: 0603 (1608 Metric); packaging: TapeAndReel; partid: 15101; Part Status: Active; price: 0.02; Ratings: AEC-Q200; series: ESD SMD Auto X7R; Size / Dimension: 0.063" L x 0.031" W (1.60mm x 0.80mm); Supplier 1: DigiKey; Supplier Part Number 1: 399-17882-1-ND; Temperature Coefficient: X7R; Thickness (Max): 0.034" (0.87mm); Tolerance: ±10%; value: 0.22 µF; Voltage - Rated: 16V
C7#2 = 10SVP10M: CAP ALUM POLY 10UF 20% 10V SMD; manufacturer: Panasonic Electronic Components; Capacitance: 10µF; ESR (Equivalent Series Resistance): 22mOhm; Lifetime @ Temp.: 2000 Hrs @ 105°C; Ripple Current @ High Frequency: 700mA @ 100kHz; Ripple Current @ Low Frequency: 35mA @ 120Hz; Surface Mount Land Size: 0.169" L x 0.169" W (4.30mm x 4.30mm); Type: Polymer; value: 10µF; Part Number: 10SVP10M; Applications: General Purpose; componentlink1description: Datasheet; componentlink1url: http://industrial.panasonic.com/www-cgi/jvcr13pz.cgi?E+CI+4+AAB8008+10SVP10M+8+WW; componentlink2description: DigiKey Link; componentlink2url: http://digikey.com/product-detail/en/panasonic-electronic-components/10SVP10M/P16427CT-ND/4204209; Device Package: Radial, Can - SMD; Height - Seated (Max): 0.217" (5.50mm); lastupdated: 02/09/2020 01:22:02; Lifecycle Status: Active; Minimum Order: 1; Mounting Type: Surface Mount; Operating Temperature: -55°C ~ 105°C; Package / Case: Radial, Can - SMD; packaging: TapeAndReel; partid: 1855; Part Status: Active; price: 0.35; series: OS-CON™, SVP; Size / Dimension: 0.157" Dia (4.00mm); Supplier 1: DigiKey; Supplier Part Number 1: P16427CT-ND; Tolerance: ±20%; Voltage - Rated: 10V
C8#2 = CL10B104KA8NNNC: as C42 on sheet Touch_sensors; Part Number: CL10B104KA8NNNC; Applications: General Purpose; componentlink1description: Datasheet; componentlink1url: http://www.samsungsem.com/kr/support/product-search/mlcc/CL10B104KA8NNNC.jsp; componentlink2description: DigiKey Link; componentlink2url: https://www.digikey.com/en/products/detail/samsung-electro-mechanics/CL10B104KA8NNNC/3886664; Device Package: 0603 (1608 Metric); lastupdated: 09/02/2024 20:10:20; Lifecycle Status: Active; Minimum Order: 1; Mounting Type: Surface Mount, MLCC; Operating Temperature: -55°C ~ 125°C; Package / Case: 0603 (1608 Metric); packaging: TapeAndReel; partid: 9793; Part Status: Active; price: 0.01; series: CL; Size / Dimension: 0.063" L x 0.031" W (1.60mm x 0.80mm); Supplier 1: DigiKey; Supplier Part Number 1: 1276-1006-1-ND; Temperature Coefficient: X7R; Thickness (Max): 0.035" (0.90mm); value: 0.1 µF; Voltage - Rated: 25V
D1 D2 = STPS2H100ZF: DIODE SCHOTTKY 100V 2A SOD123F; Manufacturer: STMicroelectronics; Current - Reverse Leakage @ Vr: 1 µA @ 100 V; Speed: Fast Recovery =< 500ns, > 200mA (Io); Voltage - Forward (Vf) (Max) @ If: 960 mV @ 4 A; Part Number: STPS2H100ZF; ComponentLink1Description: Datasheet; ComponentLink1URL: http://www.st.com/content/ccc/resource/technical/document/datasheet/group3/e0/1c/dc/bb/11/47/42/2a/DM00321023/files/DM00321023.pdf/jcr:content/translations/en.DM00321023.pdf; ComponentLink2Description: DigiKey Link; ComponentLink2URL: https://www.digikey.com/en/products/detail/stmicroelectronics/STPS2H100ZF/6709839; Current - Average Rectified (Io): 2A; Diode Type: Schottky; LastUpdated: 03/06/2024 19:54:58; Lifecycle Status: Active; Minimum Order: 1; Mounting Type: Surface Mount; Operating Temperature - Junction: -40°C ~ 175°C; Package / Case: SOD-123F; Packaging: TapeAndReel; PartId: 2348; Part Status: Active; Price: 0.06; Series: ECOPACK®2; Supplier 1: DigiKey; Supplier Part Number 1: 497-17152-1-ND; Supplier Device Package: SOD-123F; Voltage - DC Reverse (Vr) (Max): 100 V
D3 = QTLP630C4TR: LED GREEN CLEAR 0805 SMD; Manufacturer: Everlight Electronics Co Ltd; Configuration: Standard; Current - Test: 20mA; Lens Color: Colorless; Lens Size: 1.40mm x 1.25mm; Lens Style: Rectangle with Flat Top; Millicandela Rating: 10mcd; Viewing Angle: 140°; Voltage - Forward (Vf) (Typ): 2.1V; Wavelength - Dominant: 570nm; Wavelength - Peak: 565nm; Part Number: QTLP630C4TR; Color: Green; ComponentLink1Description: Datasheet; ComponentLink1URL: //media.digikey.com/PDF/Data%20Sheets/Everlight%20PDFs/QTLP630-2.pdf; ComponentLink2Description: DigiKey Link; ComponentLink2URL: https://www.digikey.com/en/products/detail/everlight-electronics-co-ltd/QTLP630C4TR/2675902; Device Package: 0805 (2012 Metric); Height (Max): 1.20mm; LastUpdated: 03/06/2024 20:00:30; Lens Transparency: Clear; Lifecycle Status: Active; Minimum Order: 1; Mounting Type: Surface Mount; Package / Case: 0805 (2012 Metric); Packaging: TapeAndReel; PartId: 240; Part Status: Active; Price: 0.05; Series: -; Size / Dimension: 2.00mm L x 1.25mm W; Supplier 1: DigiKey; Supplier Part Number 1: 1080-1411-1-ND; Supplier Device Package: 0805; Value: Green
D4 = CMP-12225-000058-1: TVS DIODE 5.25V 17V SOT666; Min Breakdown Voltage: 6V; Power Line Protection: Yes; Element Configuration: Dual; Test Current: 1mA; Working Voltage: 5V; Number of Channels: 2; Max Reverse Leakage Current: 150nA; Direction: Unidirectional; Peak Pulse Current: 5A; Number of Elements: 1; Capacitance: 3.5pF; Max Breakdown Voltage: 6V; Height: 0.6mm; Depth: 1.3mm; Contact Plating: Tin; Reverse Breakdown Voltage: 6V; REACH SVHC: No SVHC; Operating Supply Voltage: 5V; Width: 1.3mm; Max Operating Temperature: 125°C; Reverse Standoff Voltage: 5V; ESD Protection: Yes; Package Quantity: 1; Termination: SMD/SMT; Length: 1.7mm; Leakage Current: 150nA; Number of Bidirectional Channels: 2; Case/Package: SOT-666; Min Operating Temperature: -40°C; Number of Pins: 6; Clamping Voltage: 17V; Breakdown Voltage: 6V; Lead Free: Lead Free; Radiation Hardening: No; Packaging: Tape and Reel; Mount: Surface Mount; Polarity: Unidirectional
FB1 = CMP-0686-00557-7: Chip Ferrite Bead, 0603, 120Ω @ 100MHz, 0.05Ω, 25%, 2A; Impedance: 120R; Number of Circuits: 1; Shielding: Unshielded; Material: Steel; DC Resistance (DCR): 50mR; Case Code (Imperial): 0603; RoHS Compliant: Yes; Number of Pins: 2; Min Operating Temperature: -55°C; Case Code (Metric): 1608; Frequency: 100MHz; Length: 1.6mm; Test Frequency: 100MHz; Max Operating Temperature: 125°C; Packaging: Tape and Reel; Max Current Rating: 2A; Termination: SMD/SMT; Lead Free: Lead Free; Max DC Current: 2A; Case/Package: 0603; Height: 0.8mm; Current Rating: 2A; Radiation Hardening: No; Core Material: Ferrite; DC Current: 2A; REACH SVHC: No SVHC; Package Quantity: 1; Depth: 0.8mm; Number of Lines: 1; Tolerance: 25%; Width: 0.8mm
J1 = 0022272021: CONN HEADER VERT 2POS 2.54MM; Manufacturer: Molex; Contact Length - Mating: 0.295" (7.49mm); Contact Length - Post: 0.140" (3.56mm); Material Flammability Rating: UL94 V-0; Number of Positions: 2; Number of Positions Loaded: All; Overall Contact Length: 0.560" (14.22mm); Pitch - Mating: 0.100" (2.54mm); Shrouding: Shrouded - 1 Wall; Style: Board to Cable/Wire; Part Number: 0022272021; ComponentLink1Description: Datasheet; ComponentLink1URL: https://www.molex.com/pdm_docs/sd/022272021_sd.pdf; ComponentLink2Description: DigiKey Link; ComponentLink2URL: http://digikey.com/product-detail/en/molex/0022272021/WM4111-ND/1130577; Connector Type: Header; Contact Finish - Mating: Tin; Contact Finish - Post: Tin; Contact Finish Thickness - Mating: 100.0µin (2.54µm); Contact Material: Brass; Contact Shape: Square; Contact Type: Male Pin; Fastening Type: Friction Lock; Insulation Color: Natural; Insulation Height: 0.461" (11.70mm); Insulation Material: Polyamide (PA), Nylon; LastUpdated: 12/01/2020 23:51:43; Lifecycle Status: Active; Minimum Order: 1; Mounting Type: Through Hole; Number of Rows: 1; Packaging: Bulk; PartId: 76; Part Status: Active; Price: 0.27; Series: KK 6410; Supplier 1: DigiKey; Supplier Part Number 1: WM4111-ND; Termination: Solder
J2 = USB4105-GF-A-120: USB C socket; SMT; PIN: 16; top board mount; 5A
J3-J6 = B2B-XH-A(LF)(SN): as J11 on sheet Touch_sensors; Part Number: B2B-XH-A(LF)(SN); ComponentLink1Description: Datasheet; ComponentLink1URL: http://www.jst-mfg.com/product/pdf/eng/eXH.pdf; ComponentLink2Description: DigiKey Link; ComponentLink2URL: http://digikey.com/product-detail/en/jst-sales-america-inc/B2B-XH-A-LF-SN/455-2247-ND/1651045; Connector Type: Header; Contact Finish - Mating: Tin; Contact Finish - Post: Tin; Contact Material: Brass; Contact Shape: Square; Contact Type: Male Pin; Fastening Type: Detent Lock; Insulation Color: Natural; Insulation Height: 0.276" (7.00mm); Insulation Material: Polyamide (PA66), Nylon 6/6; LastUpdated: 12/01/2020 23:46:08; Lifecycle Status: Active; Minimum Order: 1; Mounting Type: Through Hole; Number of Rows: 1; Operating Temperature: -25°C ~ 85°C; Packaging: Bulk; PartId: 67; Part Status: Active; Price: 0.15; Series: XH; Supplier 1: DigiKey; Supplier Part Number 1: 455-2247-ND; Termination: Press-Fit, Solder
R1 R2 = RMCF0603JG5K10: RES 5.1K OHM 5% 1/10W 0603; Manufacturer: Stackpole Electronics Inc; Power (Watts): 0.1W, 1/10W; Resistance: 5.1 kOhms; Temperature Coefficient: ±200ppm/°C; Part Number: RMCF0603JG5K10; Value: 5.1k; ComponentLink1Description: Datasheet; ComponentLink1URL: https://www.seielect.com/catalog/sei-packaging.pdf; ComponentLink2Description: DigiKey Link; ComponentLink2URL: https://www.digikey.com/en/products/detail/stackpole-electronics-inc/RMCF0603JG5K10/1712287; Composition: Thick Film; Device Package: 0603 (1608 Metric); Features: Automotive AEC-Q200; Height - Seated (Max): 0.022" (0.55mm); LastUpdated: 09/02/2024 20:43:35; Lifecycle Status: Active; Minimum Order: 1; Number of Terminations: 2; Operating Temperature: -55°C ~ 155°C; Package / Case: 0603 (1608 Metric); Packaging: CutTape; PartId: 5180; Part Status: Active; Price: 0.01; Ratings: AEC-Q200; Series: RMCF; Size / Dimension: 0.061" L x 0.031" W (1.55mm x 0.80mm); Supplier 1: DigiKey; Supplier Part Number 1: 738-RMCF0603JG5K10CT-ND; Supplier Device Package: 0603; Tolerance: ±5%
R3 = WR06X4700FTL: RES 470 OHM 1% 1/10W 0603; Manufacturer: Walsin Technology Corporation; Power (Watts): 0.1W, 1/10W; Resistance: 470 Ohms; Temperature Coefficient: ±100ppm/°C; Part Number: WR06X4700FTL; Value: 470; ComponentLink1Description: Datasheet; ComponentLink1URL: https://www.passivecomponent.com/wp-content/uploads/chipR/ASC_WR.pdf; ComponentLink2Description: DigiKey Link; ComponentLink2URL: https://www.digikey.com/en/products/detail/walsin-technology-corporation/WR06X4700FTL/13240646; Composition: Thick Film; Device Package: 0603 (1608 Metric); Height - Seated (Max): 0.024" (0.60mm); LastUpdated: 09/02/2024 20:41:18; Lifecycle Status: Active; Minimum Order: 1; Number of Terminations: 2; Operating Temperature: -55°C ~ 155°C; Package / Case: 0603 (1608 Metric); Packaging: CutTape; PartId: 61976; Part Status: Active; Price: 0.01; Series: WR; Size / Dimension: 0.063" L x 0.031" W (1.60mm x 0.80mm); Supplier 1: DigiKey; Supplier Part Number 1: 1292-WR06X4700FTLCT-ND; Supplier Device Package: 0603; Tolerance: ±1%
R4 = AC0603JR-07120RL: RES SMD 120 OHM 5% 1/10W 0603; Manufacturer: Yageo; Power (Watts): 0.1W, 1/10W; Resistance: 120 Ohms; Temperature Coefficient: ±100ppm/°C; Part Number: AC0603JR-07120RL; Value: 120; ComponentLink1Description: Datasheet; ComponentLink1URL: https://www.yageo.com/upload/media/product/productsearch/datasheet/rchip/PYu-AC_51_RoHS_L_7.pdf; ComponentLink2Description: DigiKey Link; ComponentLink2URL: https://www.digikey.com/en/products/detail/yageo/AC0603JR-07120RL/5896364; Composition: Thick Film; Device Package: 0603 (1608 Metric); Features: Automotive AEC-Q200, Moisture Resistant; Height - Seated (Max): 0.022" (0.55mm); LastUpdated: 25/07/2024 09:19:30; Lifecycle Status: Active; Minimum Order: 1; Number of Terminations: 2; Operating Temperature: -55°C ~ 155°C; Package / Case: 0603 (1608 Metric); Packaging: CutTape; PartId: 8321; Part Status: Active; Price: 0.01; Ratings: AEC-Q200; Series: AC; Size / Dimension: 0.063" L x 0.031" W (1.60mm x 0.80mm); Supplier 1: DigiKey; Supplier Part Number 1: YAG3639CT-ND; Supplier Device Package: 0603; Tolerance: ±5%
U1 = CMP-0244-00130-1: 1.5A, Very-Low Drop Voltage Regulator, 3.3V, 3-Pin DPAK; PackageReference: TO-252; PackageDescription: 3-Pin Transistor Outline Package 2.28 mm Pitch, 9.7 mm Lead Span (DPAK); ComponentLink2Description: Datasheet; ComponentLink1URL: http://www.st.com; DatasheetVersion: 27/10/2010; ComponentLink1Description: Manufacturer URL; ComponentLink2URL: http://www.st.com/internet/com/TECHNICAL_RESOURCES/TECHNICAL_LITERATURE/DATASHEET/CD00003403.pdf; PackageVersion: 2011
U? = CMP-0315-00075-2: 3.3 V Can Transceiver, 17 mA, -40 to 85 degC, 8-pin SOIC (D), Green (RoHS & no Sb/Br); Manufacturer: Texas Instruments; Supply Voltage(s)(V): 3.3; Receivers Per Package: 1; ICC(Max)(mA): 17; Rating: Catalog; Transient Pulse Protection(V): -25 to 25; Mounting Technology: Surface Mount; PartNumber: SN65HVD232DR; Code_JEDEC: MS-012AA; Eco-Plan: Green (RoHS & no Sb/Br); Isolated: No; SubFamily: CAN; Footprint: SN65HVD232; Drivers Per Package: 1; ComponentLink1URL: http://www.ti.com/general/docs/lit/getliterature.tsp?genericPartNumber=SN65HVD232&fileType=pdf; ComponentLink1Description: Datasheet; PackageDescription: 8-Pin Plastic Small Outline Integrated Circuit, 4.9 x 3.9 mm, Pitch 1.27 mm Pitch; PackageReference: D0008A; DatasheetVersion: SLOS346K; PackageVersion: revM, Jun-2011

## Nets that join several sheets
3V3: Touch_sensors (12 pins), USB_and_CAN (6 pins)
GND: Logic_controller (37 pins), Touch_sensors (18 pins), USB_and_CAN (17 pins)